# EAGLE schematic amp_test_filter_route_3 (EAGLE 7.6.0)
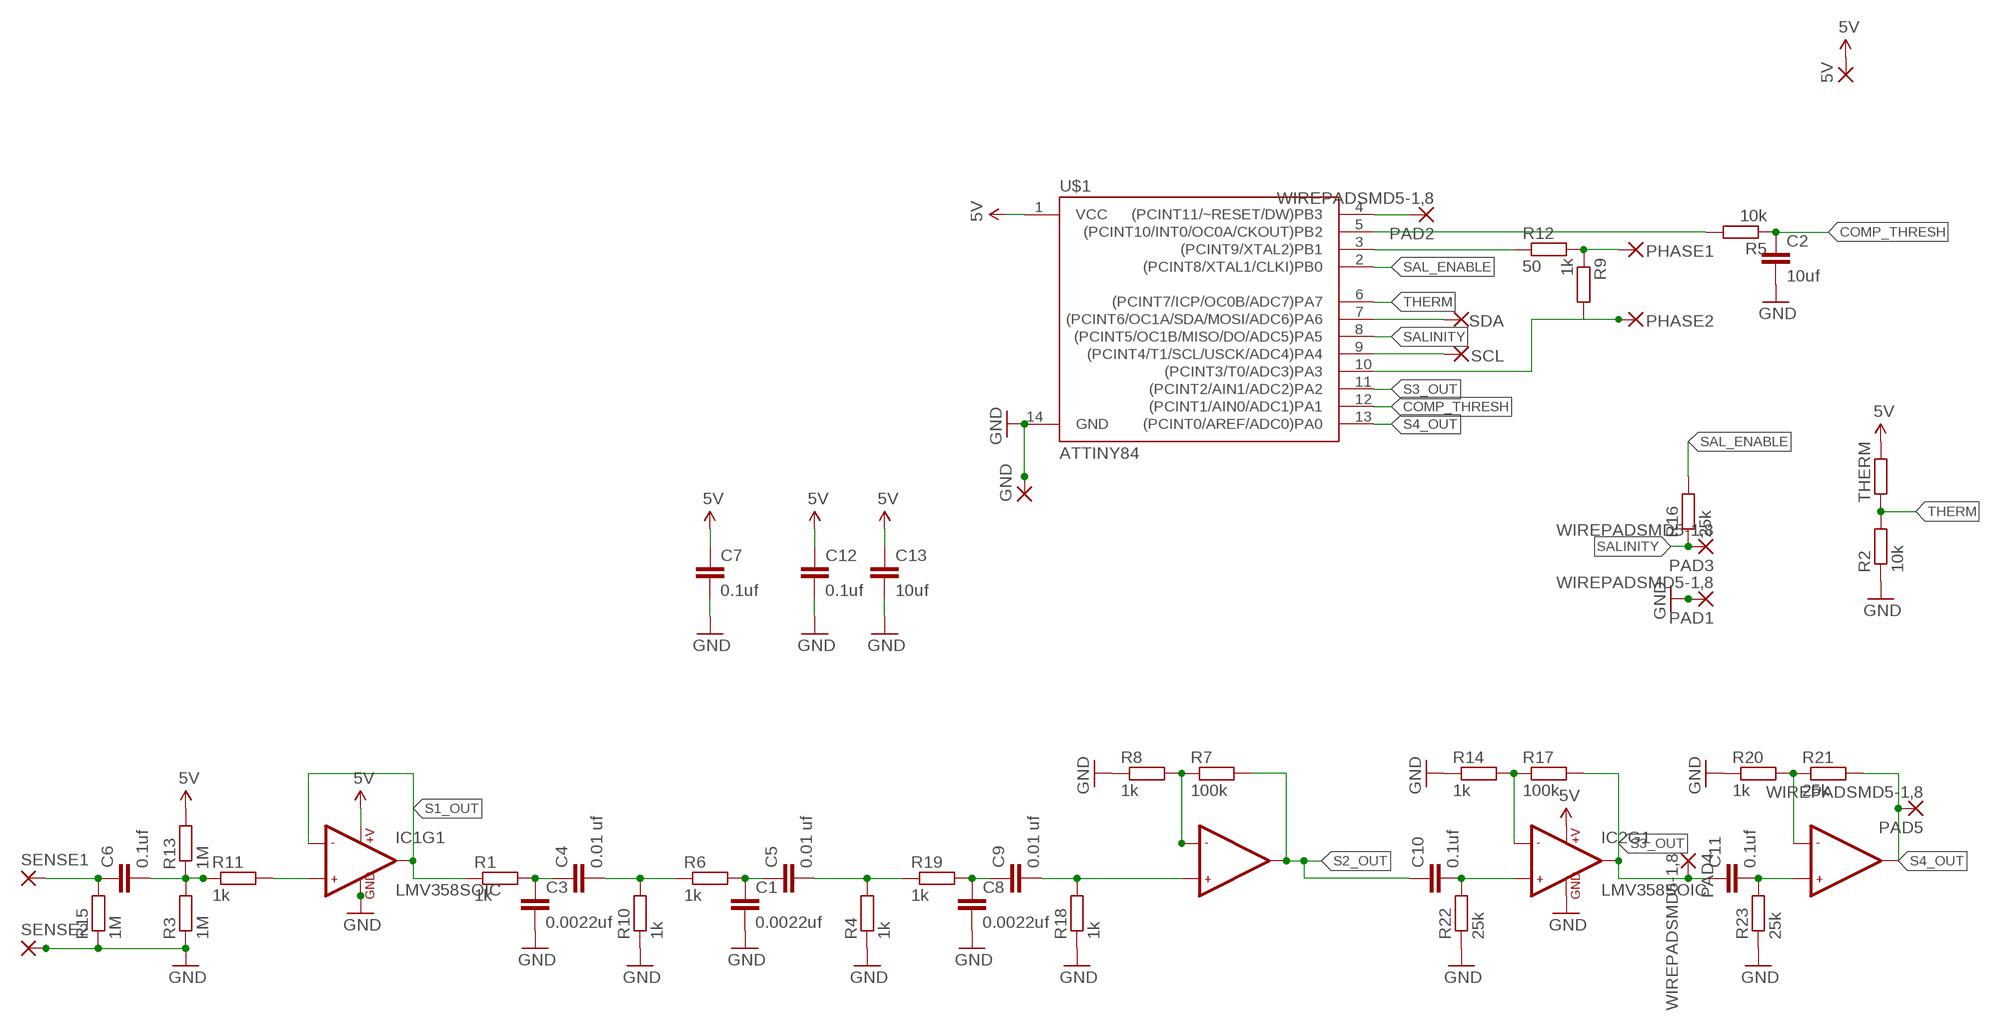
[diagram p0: schematic, sheet 1]

## Parts
5V  SMD5  [SMD2,54-5,08]
C1  0.0022uf  C-EUC0603  [C0603]
C2  10uf  C-EUC0603  [C0603]
C3  0.0022uf  C-EUC0603  [C0603]
C4  0.01 uf  C-EUC0603  [C0603]
C5  0.01 uf  C-EUC0603  [C0603]
C6  0.1uf  C-EUC0603  [C0603]
C7  0.1uf  C-EUC0603  [C0603]
C8  0.0022uf  C-EUC0603  [C0603]
C9  0.01 uf  C-EUC0603  [C0603]
C10  0.1uf  C-EUC0603  [C0603]
C11  0.1uf  C-EUC0603  [C0603]
C12  0.1uf  C-EUC0603  [C0603]
C13  10uf  C-EUC0603  [C0603]
GND  SMD5  [SMD2,54-5,08]
IC1  LMV358SOIC  [SO08]
IC2  LMV358SOIC  [SO08]
PAD1  WIREPADSMD5-1,8  [5-1,8]
PAD2  WIREPADSMD5-1,8  [5-1,8]
PAD3  WIREPADSMD5-1,8  [5-1,8]
PAD4  WIREPADSMD5-1,8  [5-1,8]
PAD5  WIREPADSMD5-1,8  [5-1,8]
PHASE1  SMD5  [SMD2,54-5,08]
PHASE2  SMD5  [SMD2,54-5,08]
R1  1k  R-EU_R0603  [R0603]
R2  10k  R-EU_R0603  [R0603]
R3  1M  R-EU_R0603  [R0603]
R4  1k  R-EU_R0603  [R0603]
R5  10k  R-EU_R0603  [R0603]
R6  1k  R-EU_R0603  [R0603]
R7  100k  R-EU_R0603  [R0603]
R8  1k  R-EU_R0603  [R0603]
R9  1k  R-EU_R0603  [R0603]
R10  1k  R-EU_R0603  [R0603]
R11  1k  R-EU_R0603  [R0603]
R12  50  R-EU_R0603  [R0603]
R13  1M  R-EU_R0603  [R0603]
R14  1k  R-EU_R0603  [R0603]
R15  1M  R-EU_R0603  [R0603]
R16  25k  R-EU_R0603  [R0603]
R17  100k  R-EU_R0603  [R0603]
R18  1k  R-EU_R0603  [R0603]
R19  1k  R-EU_R0603  [R0603]
R20  1k  R-EU_R0603  [R0603]
R21  25k  R-EU_R0603  [R0603]
R22  25k  R-EU_R0603  [R0603]
R23  25k  R-EU_R0603  [R0603]
SCL  SMD5  [SMD2,54-5,08]
SDA  SMD5  [SMD2,54-5,08]
SENSE1  SMD5  [SMD2,54-5,08]
SENSE2  SMD5  [SMD2,54-5,08]
THERM  R-EU_R0603  [R0603]
U$1  ATTINY84  [SO14]

## Nets
5V: 5V.1(P) C7.1 C12.1 C13.1 IC1.8(+V) IC2.8(+V) R13.2 THERM.2 U$1.1(VCC)
COMP_THRESH: C2.1 R5.1 U$1.12((PCINT1/AIN0/ADC1)PA1)
GND: C1.2 C2.2 C3.2 C7.2 C8.2 C12.2 C13.2 GND.1(P) IC1.4(GND) IC2.4(GND) PAD1.1(P) R2.1 R3.1 R4.1 R8.1 R10.1 R14.1 R15.1 R18.1 R20.1 R22.1 R23.1 SENSE2.1(P) U$1.14(GND)
N$1: C10.2 IC2.3(+IN1) R22.2
N$2: PHASE1.1(P) R9.1 R12.2
N$3: PHASE2.1(P) R9.2 U$1.10((PCINT3/T0/ADC3)PA3)
N$4: R5.2 U$1.5((PCINT10/INT0/OC0A/CKOUT)PB2)
N$5: C6.1 R15.2 SENSE1.1(P)
N$6: C4.2 R6.1 R10.2
N$7: C6.2 R3.2 R11.1 R13.1
N$8: IC1.3(+IN1) R11.2
N$9: C1.1 C5.1 R6.2
N$10: PAD2.1(P) U$1.4((PCINT11/~RESET/DW)PB3)
N$11: C3.1 C4.1 R1.2
N$12: R12.1 U$1.3((PCINT9/XTAL2)PB1)
N$13: C11.2 IC2.5(+IN2) R23.2
N$14: C5.2 R4.2 R19.1
N$15: IC1.6(-IN2) R7.1 R8.2
N$16: IC2.2(-IN1) R14.2 R17.1
N$17: C9.2 IC1.5(+IN2) R18.2
N$18: C8.1 C9.1 R19.2
N$21: IC2.6(-IN2) R20.2 R21.1
S1_OUT: IC1.1(OUT1) IC1.2(-IN1) R1.1
S2_OUT: C10.1 IC1.7(OUT2) R7.2
S3_OUT: C11.1 IC2.1(OUT1) PAD4.1(P) R17.2 U$1.11((PCINT2/AIN1/ADC2)PA2)
S4_OUT: IC2.7(OUT2) PAD5.1(P) R21.2 U$1.13((PCINT0/AREF/ADC0)PA0)
SAL_ENABLE: R16.2 U$1.2((PCINT8/XTAL1/CLKI)PB0)
SALINITY: PAD3.1(P) R16.1 U$1.8((PCINT5/OC1B/MISO/DO/ADC5)PA5)
SCL: SCL.1(P) U$1.9((PCINT4/T1/SCL/USCK/ADC4)PA4)
SDA: SDA.1(P) U$1.7((PCINT6/OC1A/SDA/MOSI/ADC6)PA6)
THERM: R2.2 THERM.1 U$1.6((PCINT7/ICP/OC0B/ADC7)PA7)

## Library data of the parts
5V GND PHASE1 PHASE2 SCL SDA SENSE1 SENSE2 = wirepad:SMD5: SMD PAD
C1-C13 = rcl:C-EU: CAPACITOR, European symbol
IC1 IC2 = SparkFun-AnalogIC:LMV358: Jellybean rail-to-rail output op-amp; PROD_ID: IC-09657
PAD1-PAD5 = wirepad:WIREPAD: Wire PAD connect wire on PCB
R1-R23 THERM = rcl:R-EU_: RESISTOR, European symbol
U$1 = SparkFun-DigitalIC:ATTINY84: Atmel 14-pin 2/4/8kB flash uC; PROD_ID: IC-11285

## Net classes
0 default: width 0.635 mm, drill 0.66 mm